# Altium schematic sheet Interface.SchDoc: PSDK&RFID_Ver_01
size A4; Date: 2020年12月23日
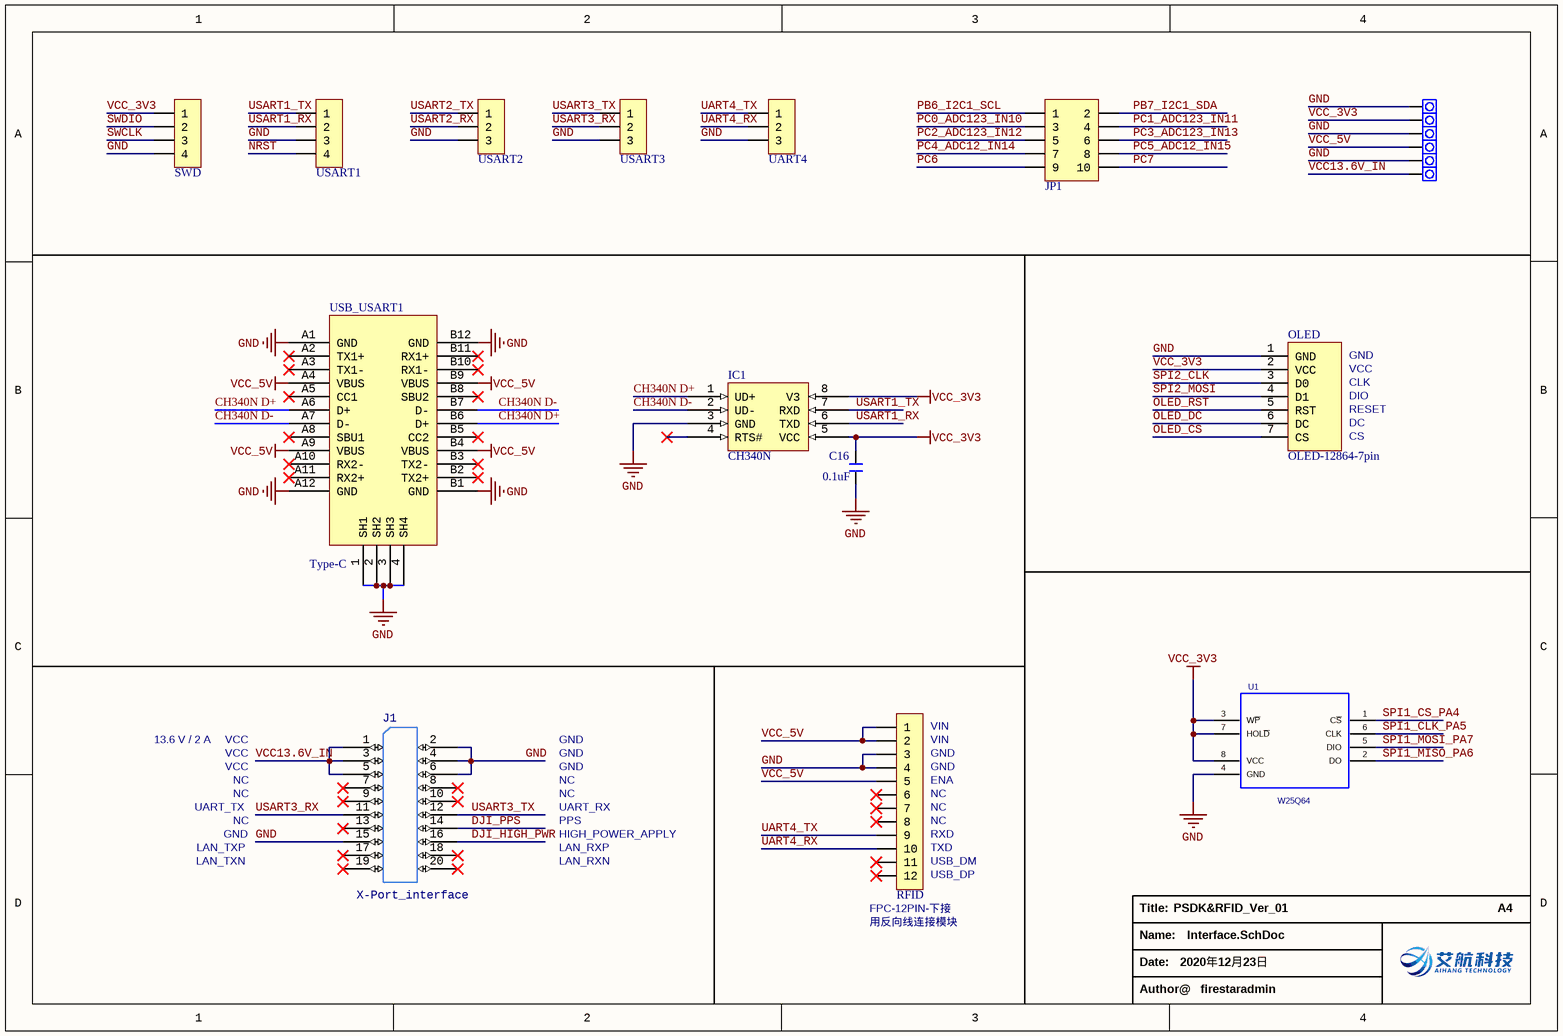
[diagram p0: Interface.SchDoc]

## Parts
C16  0.1uF  [C 0603_L]
H1  PAD  [PAD2-2.54]  (value not drawn)
H2  PAD  [PAD2-2.54]  (value not drawn)
H3  PAD  [PAD2-2.54]  (value not drawn)
IC1  CH340N  [SOP8_N]
J1  X-Port_interface  [s-50419-020xx-001]
JP1  Header 5X2  [HDR2.54-LI-2x5P]  (value not drawn)
OLED  OLED-12864-7pin  [OLED 0.96-7Pin]
RFID  FPC1.0-12P  [FPC1.0-2H-WS-12P]  (value not drawn)
SWD  HDR-1X4  [HDR2.54-LI-4P]  (value not drawn)
U1  W25Q64  [SOP8W_L]
UART4  HDR-1X4  [HDR2.54-LI-3P]  (value not drawn)
USART1  HDR-1X4  [HDR2.54-LI-4P]  (value not drawn)
USART2  HDR-1X4  [HDR2.54-LI-3P]  (value not drawn)
USART3  HDR-1X4  [HDR2.54-LI-3P]  (value not drawn)
USB_USART1  Type-C  [Type-C]

## Nets
GND: C16.1 H1.1 H2.1 H3.1 IC1.3(GND) J1.2 J1.4 J1.6 J1.15 OLED.1(GND) RFID.3 RFID.4 SWD.4 U1.4(GND) UART4.3 USART1.3 USART2.3 USART3.3 USB_USART1.1(SH1) USB_USART1.2(SH2) USB_USART1.3(SH3) USB_USART1.4(SH4) USB_USART1.A1(GND) USB_USART1.A12(GND) USB_USART1.B1(GND) USB_USART1.B12(GND)
VCC_3V3: C16.2 H1.2 IC1.5(VCC) IC1.8(V3) OLED.2(VCC) SWD.1 U1.3(W~{P}) U1.7(HOL~{D}) U1.8(VCC)
VCC_5V: H2.2 RFID.1 RFID.2 RFID.5 USB_USART1.A4(VBUS) USB_USART1.A9(VBUS) USB_USART1.B4(VBUS) USB_USART1.B9(VBUS)
CH340N D+: IC1.1(UD+) USB_USART1.A6(D+) USB_USART1.B6(D+)
CH340N D-: IC1.2(UD-) USB_USART1.A7(D-) USB_USART1.B7(D-)
DJI_HIGH_PWR: J1.16
DJI_PPS: J1.14
NRST: USART1.4
OLED_CS: OLED.7(CS)
OLED_DC: OLED.6(DC)
OLED_RST: OLED.5(RST)
PB6_I2C1_SCL: JP1.1
PB7_I2C1_SDA: JP1.2
PC0_ADC123_IN10: JP1.3
PC1_ADC123_IN11: JP1.4
PC2_ADC123_IN12: JP1.5
PC3_ADC123_IN13: JP1.6
PC4_ADC12_IN14: JP1.7
PC5_ADC12_IN15: JP1.8
PC6: JP1.9
PC7: JP1.10
SPI1_CLK_PA5: U1.6(CLK)
SPI1_CS_PA4: U1.1(C~{S})
SPI1_MISO_PA6: U1.2(DO)
SPI1_MOSI_PA7: U1.5(DIO)
SPI2_CLK: OLED.3(D0)
SPI2_MOSI: OLED.4(D1)
SWCLK: SWD.3
SWDIO: SWD.2
UART4_RX: RFID.10 UART4.2
UART4_TX: RFID.9 UART4.1
USART1_RX: IC1.6(TXD) USART1.2
USART1_TX: IC1.7(RXD) USART1.1
USART2_RX: USART2.2
USART2_TX: USART2.1
USART3_RX: J1.11 USART3.2
USART3_TX: J1.12 USART3.1
VCC13.6V_IN: H3.2 J1.1 J1.3 J1.5

Not connected (* = marked no-connect by the designer): IC1 4(RTS#)*; J1 7* 8* 9* 10* 13* 17* 18* 19* 20*; RFID 6* 7* 8* 11* 12*; USB_USART1 A2(TX1+)* A3(TX1-)* A5(CC1)* A8(SBU1)* A10(RX2-)* A11(RX2+)* B2(TX2+)* B3(TX2-)* B5(CC2)* B8(SBU2)* B10(RX1-)* B11(RX1+)*

## Notes on the sheet
- GND
- VCC
- CLK
- DIO
- RESET
- DC
- CS
- 13.6 V / 2 A
- NC
- (near RFID) VIN
- (near RFID) GND
- (near RFID) ENA
- UART_TX
- LAN_TXP
- UART_RX
- PPS
- HIGH_POWER_APPLY
- LAN_RXP
- (near RFID) NC
- (near RFID) RXD
- (near RFID) TXD
- LAN_TXN
- LAN_RXN
- (near RFID) FPC-12PIN-下接
- (near RFID) 用反向线连接模块
- (near RFID) USB_DM
- (near RFID) USB_DP
- Title:
- A4
- Name:
- Date:
- Author@
- firestaradmin

## Library data of the parts
C16 = C: 无极性贴片电容; 版权归属: 源创客; BOM名称: 无极性贴片电容; 学习资源: www.ooocke.com
H1-H3 = PAD2: 引线焊盘; 版权归属: 源创客; BOM名称: 引线焊盘; 学习资源: www.ooocke.com
IC1 = CH340N: USB 转串口芯片 CH330/CH340N
J1 = s-50419-020xx-001: 20Pin-1.0MM-板对线连接器母座-WTB Wafer Conn.SMT D/R S/T Type.
JP1 = Header 5X2: 5*2P接插件; 版权归属: 源创客; BOM名称: 5*2P接插件; 学习资源: www.ooocke.com
OLED = OLED-7pin-128x64-模组: OLED显示屏12864液晶屏串口oled模块ssd1306 12864OLED屏; BOM名称: 12864 点阵屏; 版权归属: 源创客; 学习资源: www.ooocke.com
RFID = FPC-12P: FPC连接器; 版权归属: 源创客; BOM名称: FPC连接器; 学习资源: www.ooocke.com
SWD USART1 = Header 4: 4P接插件; 版权归属: 源创客; BOM名称: 4P接插件; 学习资源: www.ooocke.com
U1 = W25Q64: PCB DECAL: SO8WB
UART4 USART2 USART3 = Header 3: 3P接插件; 版权归属: 源创客; BOM名称: 3P接插件; 学习资源: www.ooocke.com